# EasyEDA schematic SCH_cool_thing_2025-05-27.json
TITLE: Sheet_1; REV: 1.0; Date: 2025-04-08; Sheet: 1/1; Drawn By: ministermonkeya1; Company: Your Company
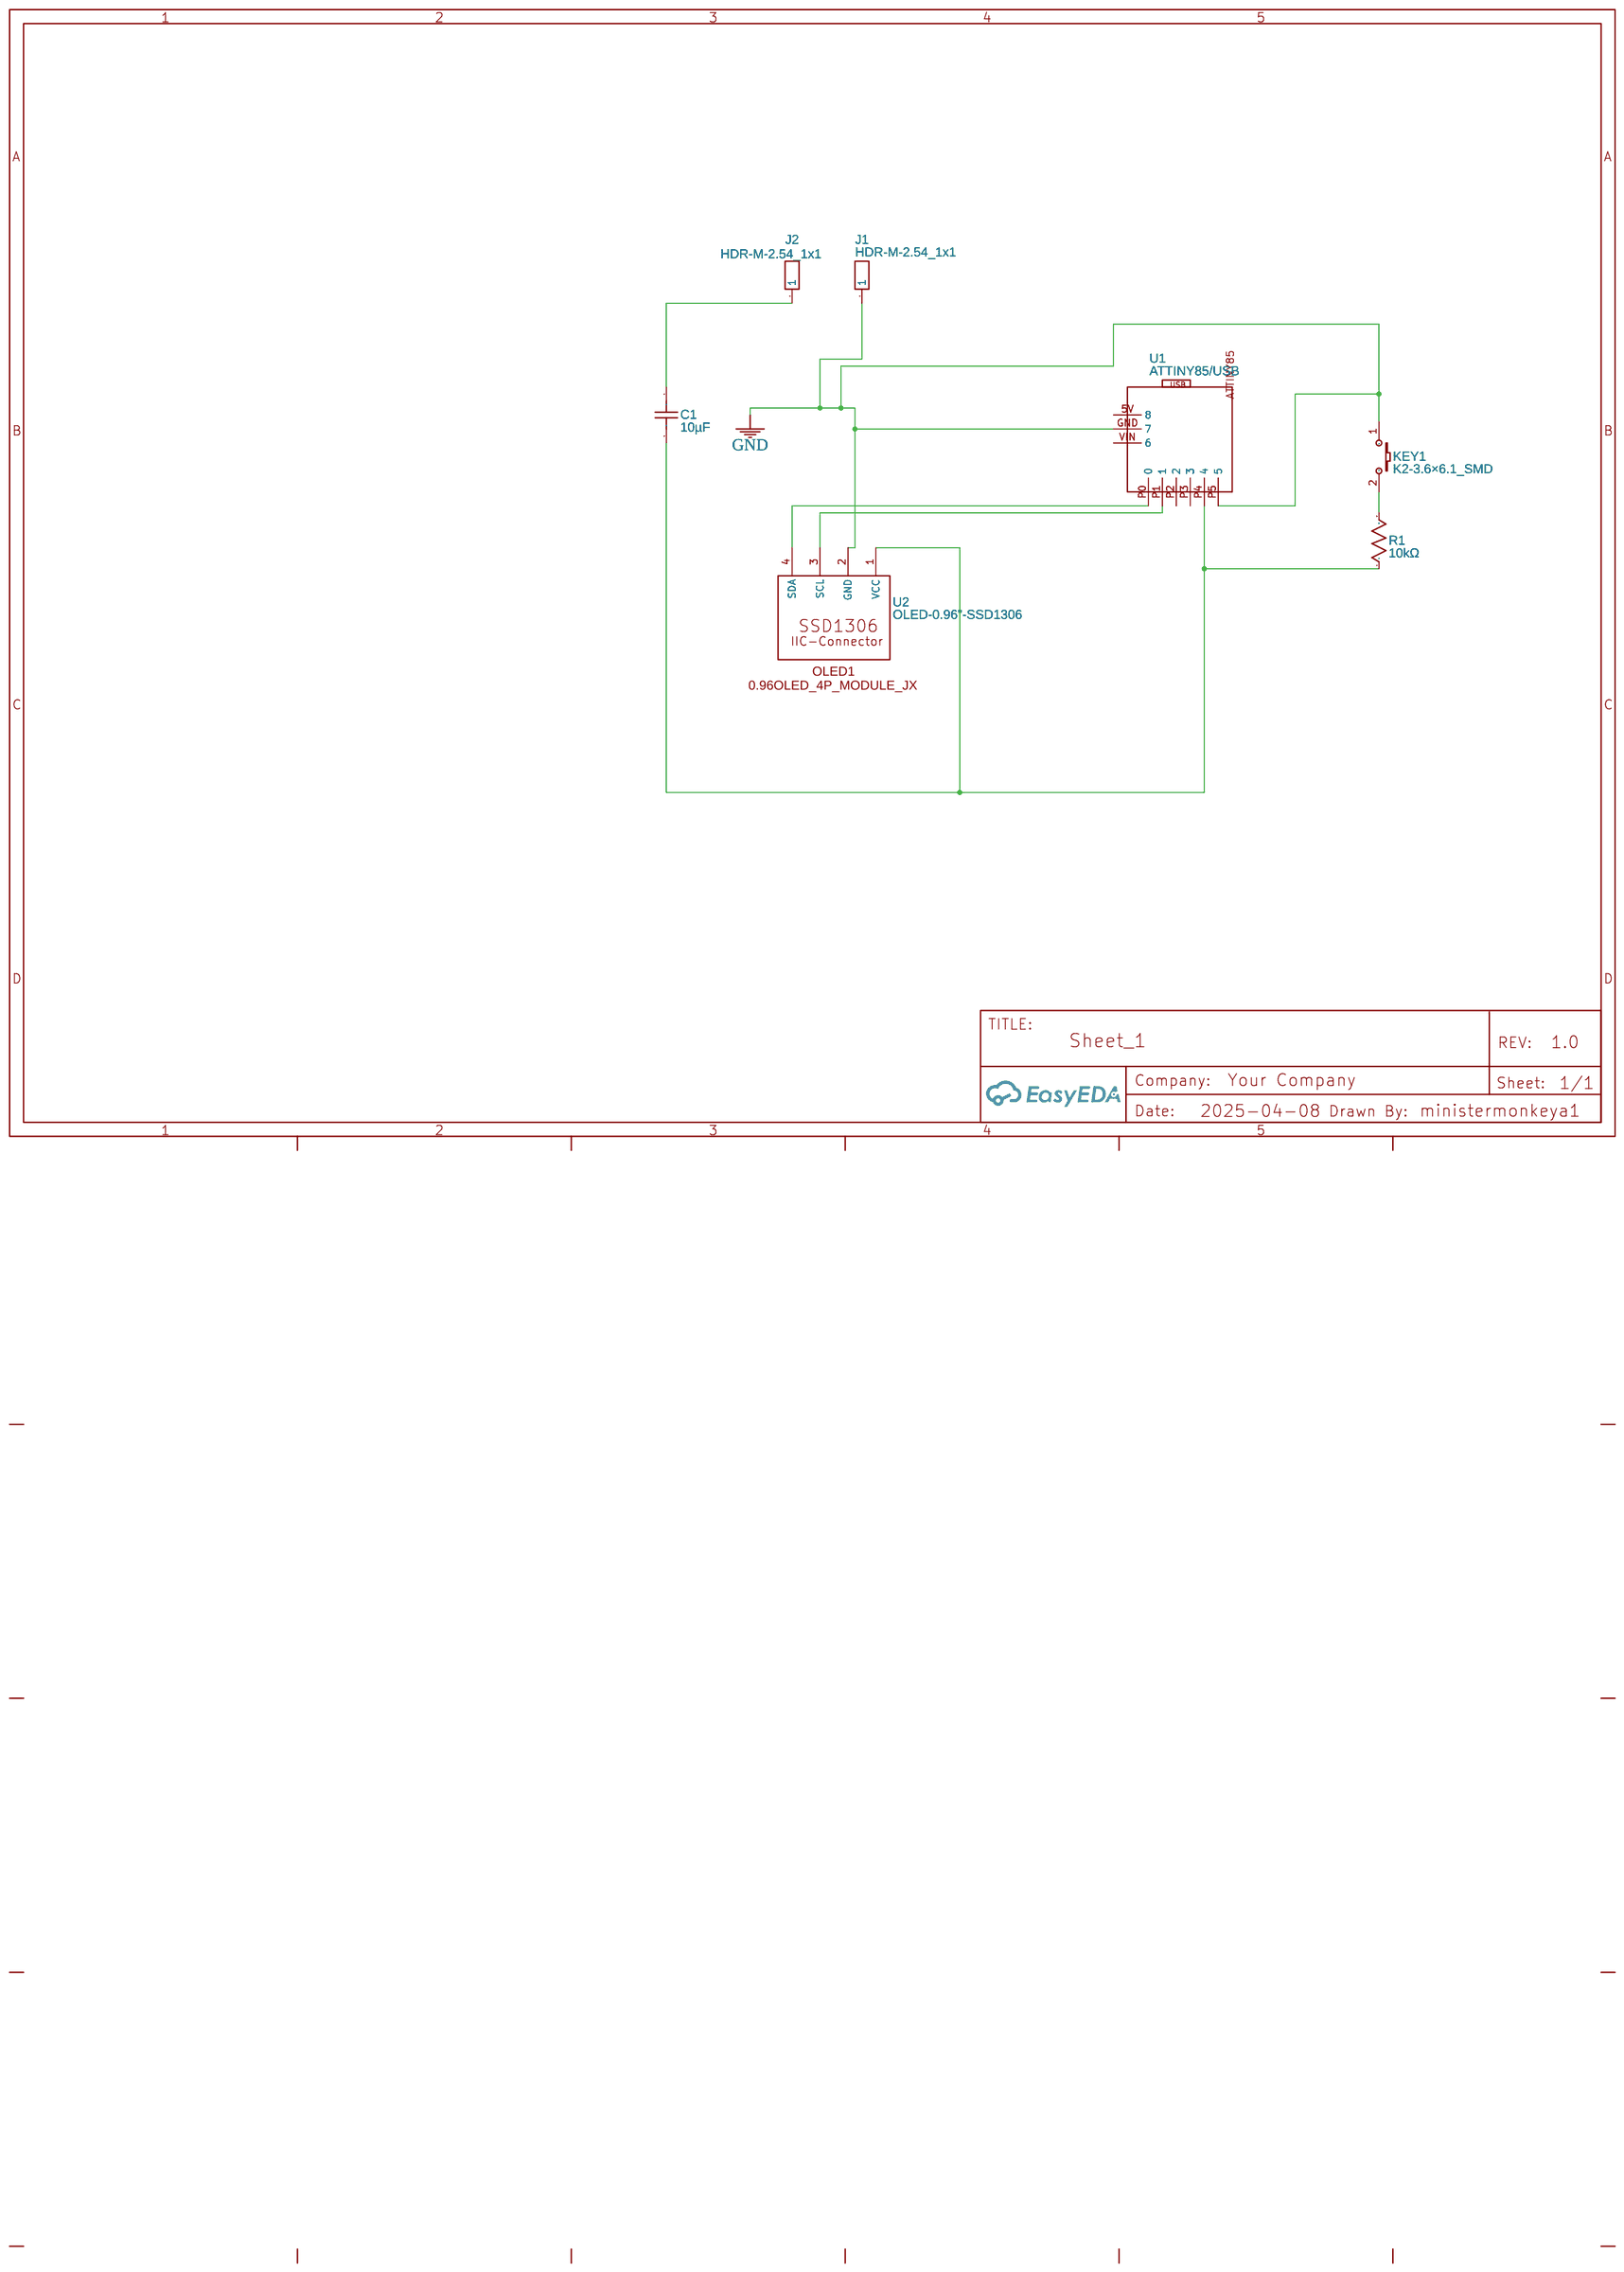
[diagram p0: schematic sheet]

## Parts
C1  10µF  [C0603]
J1  HDR-M-2.54_1x1  [HDR-M-2.54_1X1]
J2  HDR-M-2.54_1x1  [HDR-M-2.54_1X1]
KEY1  K2-3.6×6.1_SMD  [KEY-SMD_2P-L6.2-W3.6-LS8.0]
R1  10kΩ  [R0603]
U1  ATTINY85/USB  [DIGISPARK]
U2  OLED-0.96"-SSD1306  [OLED-0.96"-SSD1306]

## Library data of the parts
C1 = C_0603_US: Contributor: LCEDA_Lib
J1 J2 = HDR-M-2.54_1x1: Supplier Part: C81276; Supplier: LCSC; Contributor: LCEDA_Lib
KEY1 = K2-3.6×6.1_SMD: Supplier Part: C118141; Supplier: LCSC; Manufacturer Part: K2-1107ST-A4SW-06; Contributor: LCEDA_Lib; 制造商: 韩国韩荣
R1 = R_0603_US: Contributor: LCEDA_Lib
U1 = ATTINY85/USB: Contributor: loydsouza999
U2 = OLED-0.96"-SSD1306: Contributor: alfitomuwahid

## Nets
GND: J1.1 KEY1.1 U1.GND(7) U1.P5(5) U2.2(GND)
Net-(C1-1): C1.1 J2.1
Net-(C1-2): C1.2 R1.1 U1.P4(4) U2.1(VCC)
Net-(KEY1-2): KEY1.2 R1.2
Net-(U1-P0): U1.P0(0) U2.4(SDA)
Net-(U1-P1): U1.P1(1) U2.3(SCL)

Not connected (* = marked no-connect by the designer): U1 5V(8) P2(2) P3(3) VIN(6)
